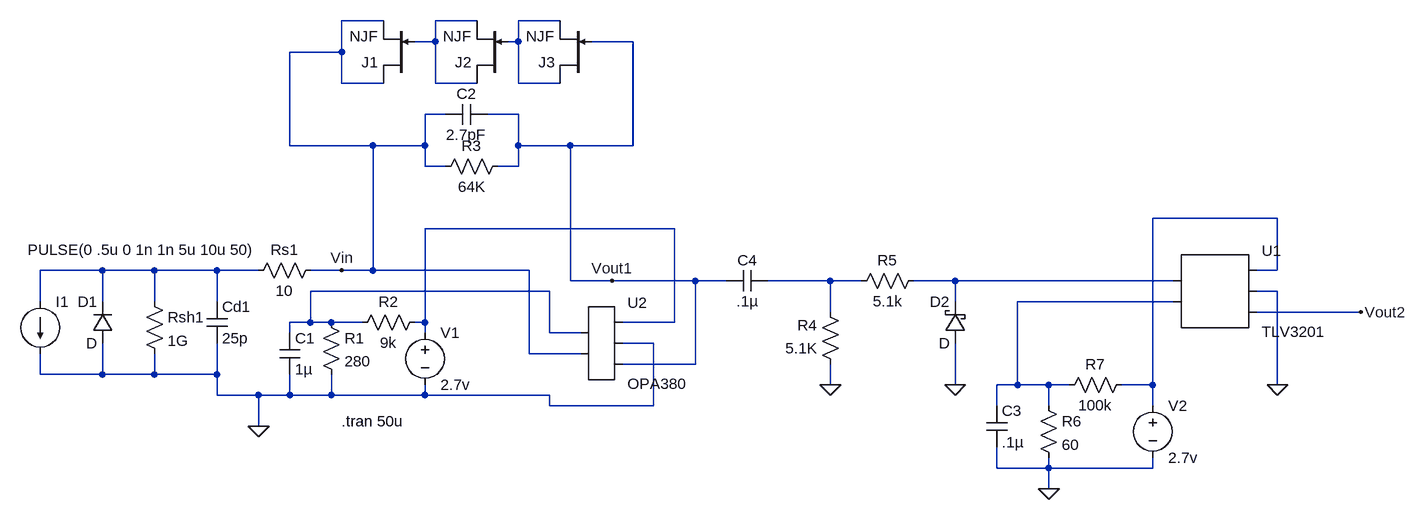
[diagram p0: schematic space_split_communication_2.7v.asc]
space_split_communication_2.7v.asc, the LTspice schematic file:
Version 4
SHEET 1 1472 704
WIRE -112 -32 -176 -32
WIRE 32 -32 -32 -32
WIRE 160 -32 96 -32
WIRE -32 0 -32 -32
WIRE -32 0 -64 0
WIRE 96 0 96 -32
WIRE 96 0 80 0
WIRE 272 0 208 0
WIRE -176 16 -176 -32
WIRE -176 16 -256 16
WIRE -176 64 -176 16
WIRE -112 64 -176 64
WIRE -32 64 -32 0
WIRE 32 64 -32 64
WIRE 96 64 96 0
WIRE 160 64 96 64
WIRE -16 112 -48 112
WIRE 96 112 48 112
WIRE -256 160 -256 16
WIRE -128 160 -256 160
WIRE -48 160 -48 112
WIRE -48 160 -128 160
WIRE 96 160 96 112
WIRE 176 160 96 160
WIRE 272 160 272 0
WIRE 272 160 176 160
WIRE -48 192 -48 160
WIRE -16 192 -48 192
WIRE 96 192 96 160
WIRE 96 192 64 192
WIRE 1264 272 1072 272
WIRE 336 288 -48 288
WIRE -544 352 -640 352
WIRE -464 352 -544 352
WIRE -368 352 -464 352
WIRE -304 352 -368 352
WIRE -176 352 -224 352
WIRE -128 352 -128 160
WIRE -128 352 -176 352
WIRE 112 352 -128 352
WIRE 1264 352 1264 272
WIRE 1264 352 1232 352
WIRE 176 368 176 160
WIRE 240 368 176 368
WIRE 368 368 240 368
WIRE 416 368 368 368
WIRE 576 368 480 368
WIRE 624 368 576 368
WIRE 768 368 704 368
WIRE 1104 368 768 368
WIRE 144 384 -224 384
WIRE 1264 384 1232 384
WIRE -640 400 -640 352
WIRE -544 400 -544 352
WIRE -464 400 -464 352
WIRE -368 400 -368 352
WIRE 768 400 768 368
WIRE 1104 400 864 400
WIRE 576 416 576 368
WIRE 1392 416 1232 416
WIRE -224 432 -224 384
WIRE -224 432 -256 432
WIRE -192 432 -224 432
WIRE -144 432 -192 432
WIRE -48 432 -48 288
WIRE -48 432 -64 432
WIRE 336 432 336 288
WIRE 336 432 256 432
WIRE -256 448 -256 432
WIRE -48 448 -48 432
WIRE 144 448 144 384
WIRE 192 448 144 448
WIRE 304 464 256 464
WIRE 112 480 112 352
WIRE 192 480 112 480
WIRE 368 496 368 368
WIRE 368 496 256 496
WIRE -640 512 -640 480
WIRE -544 512 -544 464
WIRE -544 512 -640 512
WIRE -464 512 -464 480
WIRE -464 512 -544 512
WIRE -368 512 -368 464
WIRE -368 512 -464 512
WIRE 576 528 576 496
WIRE 768 528 768 464
WIRE 864 528 864 400
WIRE 864 528 832 528
WIRE 912 528 864 528
WIRE 944 528 912 528
WIRE 1072 528 1072 272
WIRE 1072 528 1024 528
WIRE 1264 528 1264 384
WIRE -368 544 -368 512
WIRE -304 544 -368 544
WIRE -256 544 -256 512
WIRE -256 544 -304 544
WIRE -192 544 -192 512
WIRE -192 544 -256 544
WIRE -48 544 -48 528
WIRE -48 544 -192 544
WIRE 144 544 -48 544
WIRE 144 560 144 544
WIRE 304 560 304 464
WIRE 304 560 144 560
WIRE 832 560 832 528
WIRE 912 560 912 528
WIRE 1072 560 1072 528
WIRE -304 592 -304 544
WIRE 832 656 832 624
WIRE 912 656 912 640
WIRE 912 656 832 656
WIRE 1072 656 1072 640
WIRE 1072 656 912 656
WIRE 912 688 912 656
FLAG 240 368 Vout1
FLAG -176 352 Vin
FLAG -304 592 0
FLAG 576 528 0
FLAG 1264 528 0
FLAG 912 688 0
FLAG 768 528 0
FLAG 1392 416 Vout2
SYMBOL res -480 384 R0
SYMATTR InstName Rsh1
SYMATTR Value 1G
SYMBOL cap -384 400 R0
SYMATTR InstName Cd1
SYMATTR Value 25p
SYMBOL res -208 336 R90
WINDOW 0 0 56 VBottom 2
WINDOW 3 32 56 VTop 2
SYMATTR InstName Rs1
SYMATTR Value 10
SYMBOL current -640 400 R0
WINDOW 3 -19 -80 Left 2
SYMATTR Value PULSE(0 .5u 0 1n 1n 5u 10u 50)
SYMATTR InstName I1
SYMATTR Value2 AC 0 0
SYMBOL diode -528 464 R180
WINDOW 0 24 64 Left 2
WINDOW 3 24 0 Left 2
SYMATTR InstName D1
SYMBOL Res -208 416 R0
SYMATTR InstName R1
SYMATTR Value 280
SYMBOL Res -48 416 R90
WINDOW 0 0 56 VBottom 2
WINDOW 3 32 56 VTop 2
SYMATTR InstName R2
SYMATTR Value 9k
SYMBOL Cap -272 448 R0
SYMATTR InstName C1
SYMATTR Value 1µ
SYMBOL voltage -48 432 R0
SYMATTR InstName V1
SYMATTR Value 2.7v
SYMBOL Res 80 176 R90
WINDOW 0 0 56 VBottom 2
WINDOW 3 32 56 VTop 2
SYMATTR InstName R3
SYMATTR Value 64K
SYMBOL Cap 48 96 R90
WINDOW 0 0 32 VBottom 2
WINDOW 3 32 32 VTop 2
SYMATTR InstName C2
SYMATTR Value 2.7pF
SYMBOL njf -64 64 R180
SYMATTR InstName J1
SYMBOL njf 80 64 R180
SYMATTR InstName J2
SYMBOL njf 208 64 R180
SYMATTR InstName J3
SYMBOL Res 592 512 R180
WINDOW 0 36 76 Left 2
WINDOW 3 36 40 Left 2
SYMATTR InstName R4
SYMATTR Value 5.1K
SYMBOL Res 720 352 R90
WINDOW 0 0 56 VBottom 2
WINDOW 3 32 56 VTop 2
SYMATTR InstName R5
SYMATTR Value 5.1k
SYMBOL schottky 784 464 R180
WINDOW 0 24 64 Left 2
WINDOW 3 24 0 Left 2
SYMATTR InstName D2
SYMBOL AutoGenerated/TLV3201 1168 384 R0
SYMATTR InstName U1
SYMBOL Cap 816 560 R0
SYMATTR InstName C3
SYMATTR Value .1µ
SYMBOL Res 896 544 R0
SYMATTR InstName R6
SYMATTR Value 60
SYMBOL Voltage 1072 544 R0
SYMATTR InstName V2
SYMATTR Value 2.7v
SYMBOL Res 1040 512 R90
WINDOW 0 0 56 VBottom 2
WINDOW 3 32 56 VTop 2
SYMATTR InstName R7
SYMATTR Value 100k
SYMBOL Cap 480 352 R90
WINDOW 0 0 32 VBottom 2
WINDOW 3 32 32 VTop 2
SYMATTR InstName C4
SYMATTR Value .1µ
SYMBOL AutoGenerated/OPA380 224 464 R0
SYMATTR InstName U2
TEXT -176 584 Left 2 !.tran 50u

The netlist it stands for:
* space_split_communication_2.7v.asc
Rsh1 N005 0 1G
Cd1 N005 0 25p
Rs1 Vin N005 10
I1 N005 0 PULSE(0 .5u 0 1n 1n 5u 10u 50) AC 0 0
D1 0 N005 D
R1 N008 0 280
R2 N004 N008 9k
C1 N008 0 1µ
V1 N004 0 2.7v
R3 Vout1 Vin 64K
C2 Vout1 Vin 2.7pF
J1 Vin N001 Vin NJF
J2 N001 N002 N001 NJF
J3 N002 Vout1 N002 NJF
R4 0 N006 5.1K
R5 N007 N006 5.1k
D2 0 N007 D
* U1: TLV3201 (symbol AutoGenerated/TLV3201 not available, pins judged from their places): pin1=N007 pin2=N009 pin3=N003 pin4=0 pin5=Vout2
C3 N009 0 .1µ
R6 N009 0 60
V2 N003 0 2.7v
R7 N003 N009 100k
C4 N006 Vout1 .1µ
* U2: OPA380 (symbol AutoGenerated/OPA380 not available, pins judged from their places): pin1=N008 pin2=Vin pin3=N004 pin4=0 pin5=Vout1
.model D D
.lib standard.dio
.model NJF NJF
.model PJF PJF
.lib standard.jft
.tran 50u
.backanno
.end